# EAGLE schematic controller_main_board (EAGLE 8.3.2)
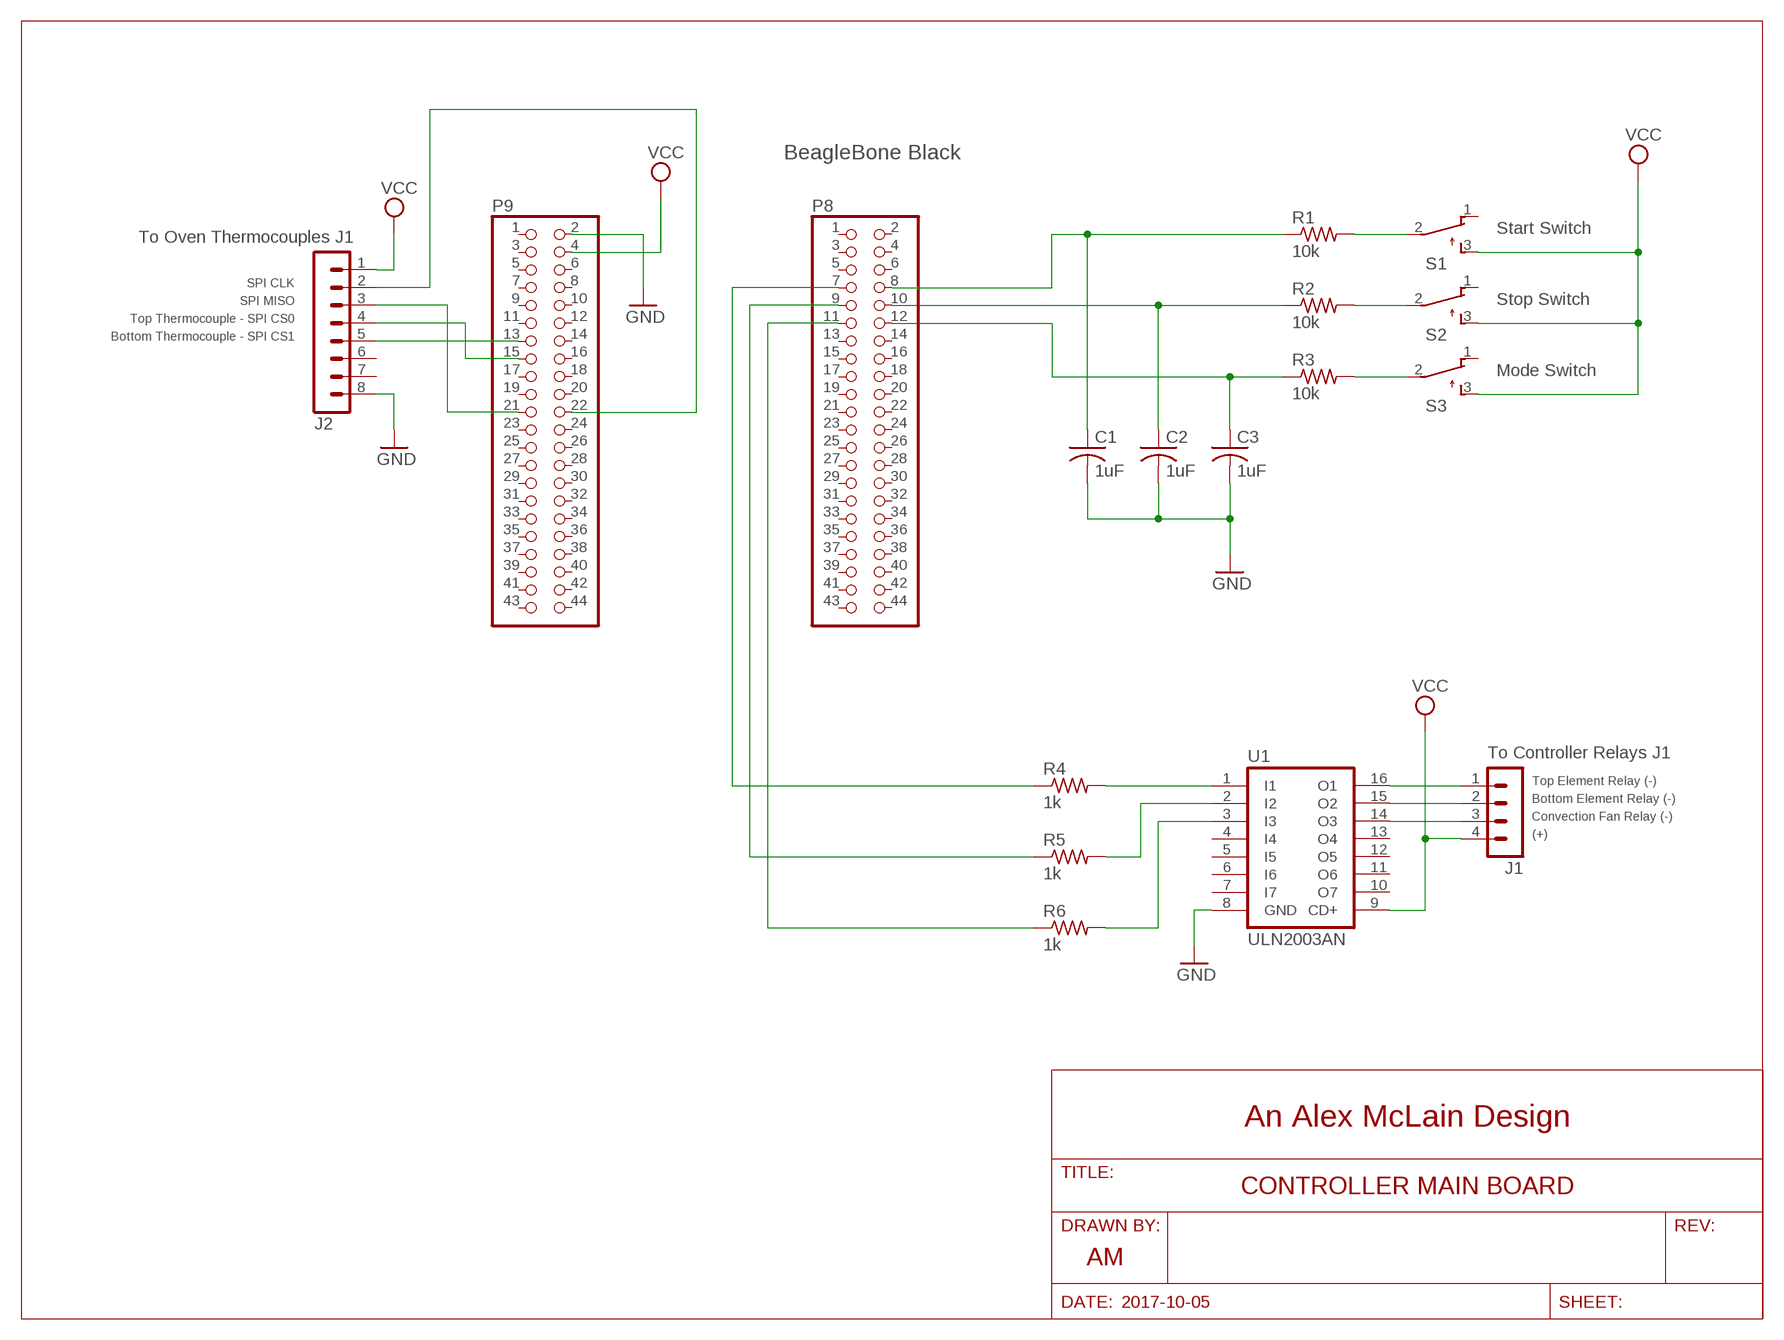
[diagram p0: schematic, sheet 1]
FRAME1 (LETTER_L): COMPANY_NAME: An Alex McLain Design; DATE_DRAWN: 2017-10-05; DRAWN_BY: AM; TITLE: CONTROLLER MAIN BOARD

## Parts
C1  1uF  C-US025-050X050  [C025-050X050]
C2  1uF  C-US025-050X050  [C025-050X050]
C3  1uF  C-US025-050X050  [C025-050X050]
J1  MA04-1  [MA04-1]
J2  MA08-1  [MA08-1]
P8  PINHD-2X22  [2X22]
P9  PINHD-2X22  [2X22]
R1  10k  R-US_0204/7  [0204/7]
R2  10k  R-US_0204/7  [0204/7]
R3  10k  R-US_0204/7  [0204/7]
R4  1k  R-US_0204/7  [0204/7]
R5  1k  R-US_0204/7  [0204/7]
R6  1k  R-US_0204/7  [0204/7]
S1  TL32PO  [TL3XPO]
S2  TL32PO  [TL3XPO]
S3  TL32PO  [TL3XPO]
U1  ULN2003AN  [DIL16]

## Nets
GND: C1.2 C2.2 C3.2 J2.8 P9.2 U1.8(GND)
N$1: C1.1 P8.8 R1.1
N$2: C2.1 P8.10 R2.1
N$3: C3.1 P8.12 R3.1
N$4: P8.11 R6.1
N$5: P8.9 R5.1
N$6: P8.7 R4.1
N$7: R1.2 S1.2(P)
N$8: R2.2 S2.2(P)
N$9: R3.2 S3.2(P)
N$10: R4.2 U1.1(I1)
N$11: R5.2 U1.2(I2)
N$12: R6.2 U1.3(I3)
N$13: J1.1 U1.16(O1)
N$14: J1.2 U1.15(O2)
N$15: J1.3 U1.14(O3)
N$16: J2.5 P9.13
N$17: J2.4 P9.15
N$18: J2.3 P9.21
N$19: J2.2 P9.22
VCC: J1.4 J2.1 P9.4 S1.3(S) S2.3(S) S3.3(S) U1.9(CD+)
Unconnected: J2.6 J2.7 P8.1 P8.2 P8.3 P8.4 P8.5 P8.6 P8.13 P8.14 P8.15 P8.16 P8.17 P8.18 P8.19 P8.20 P8.21 P8.22 P8.23 P8.24 P8.25 P8.26 P8.27 P8.28 P8.29 P8.30 P8.31 P8.32 P8.33 P8.34 P8.35 P8.36 P8.37 P8.38 P8.39 P8.40 P8.41 P8.42 P8.43 P8.44 P9.1 P9.3 P9.5 P9.6 P9.7 P9.8 P9.9 P9.10 P9.11 P9.12 P9.14 P9.16 P9.17 P9.18 P9.19 P9.20 P9.23 P9.24 P9.25 P9.26 P9.27 P9.28 P9.29 P9.30 P9.31 P9.32 P9.33 P9.34 P9.35 P9.36 P9.37 P9.38 P9.39 P9.40 P9.41 P9.42 P9.43 P9.44 S1.1(O) S2.1(O) S3.1(O) U1.4(I4) U1.5(I5) U1.6(I6) U1.7(I7) U1.10(O7) U1.11(O6) U1.12(O5) U1.13(O4)

## Notes on the sheet
- BeagleBone Black
- To Oven Thermocouples J1 | Start Switch
- SPI CLK
- SPI MISO
- Stop Switch
- Top Thermocouple - SPI CS0
- Bottom Thermocouple - SPI CS1
- Mode Switch
- To Controller Relays J1
- Top Element Relay (-)
- Bottom Element Relay (-)
- Convection Fan Relay (-)
- (+)

## Library data of the parts
C1-C3 = rcl:C-US: CAPACITOR, American symbol
J1 = con-lstb:MA04-1: PIN HEADER; OC_FARNELL: unknown; OC_NEWARK: unknown
J2 = con-lstb:MA08-1: PIN HEADER; OC_FARNELL: unknown; OC_NEWARK: unknown
P8 P9 = pinhead:PINHD-2X22: PIN HEADER
R1-R6 = rcl:R-US_: RESISTOR, American symbol
S1-S3 = switch:TL32PO: TINY SWITCH ON - MOM Source: http://www2.produktinfo.conrad.com/datenblaetter/700000-724999/705152-da-01-de-Subminiaturschalter_TL_36YO.pdf
U1 = uln-udn:ULN2003A: DRIVER ARRAY